# Altium project PWR_REVE.PrjPcb
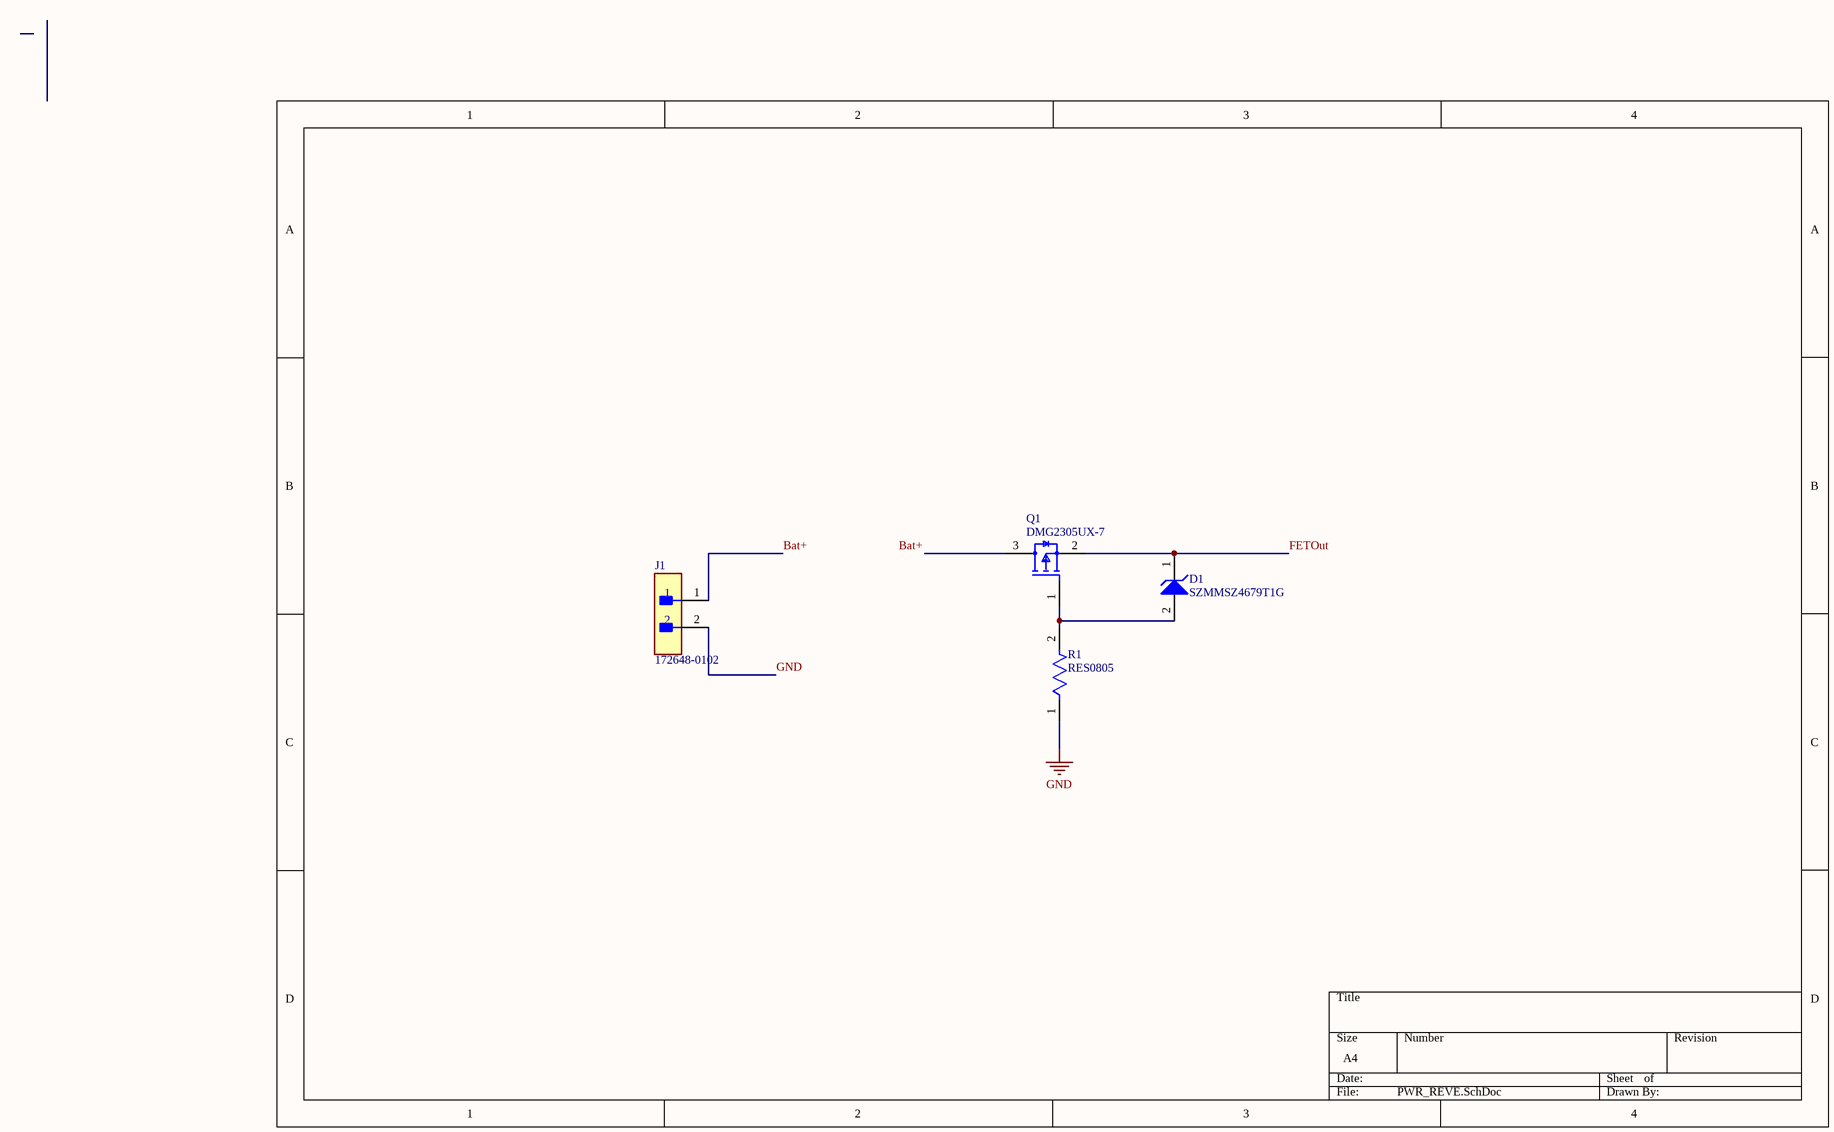
[diagram p0: PWR_REVE.SchDoc]
2 sheets, 16 parts. Net scope: global (net labels, ports and power ports of the same name join across sheets).
Board file: PWR_REVE.PcbDoc
Sheets:
  PWR_REVE.SchDoc
  PWR_REVE_2.SchDoc

## Sheet PWR_REVE.SchDoc
size A4; SheetNumber: 1; SheetTotal: 2

### Parts
D1  SZMMSZ4679T1G  [ONSC-SOD-123-2-425-04_V]
J1  172648-0102  [FP-172648-0102-MFG]
Q1  DMG2305UX-7  [FP-SOT23-IPC_B]
R1  RES0805  [FP-RMCF0805-IPC_C]

### Nets
GND: J1.2 R1.1
Bat+: J1.1 Q1.3(DRAIN)
FETOut: D1.1(K) Q1.2(SOURCE)
NetD1_2: D1.2(A) Q1.1(GATE) R1.2

### Library data of the parts
D1 = CMP-1060-00472-1: Zener Voltage Regulator, 500 mW, 2-Pin SOD-123, Pb-Free, Tape and Reel; Manufacturer: On Semiconductor; P Max (W): 0.5; VZ Typ (V): 2; ComponentLink3Description: Package Specification; Mounting Technology: Surface Mount; ComponentLink1URL: http://www.onsemi.com/; PackageVersion: Rev. G, 10/2009; ComponentLink3URL: http://www.onsemi.com/pub_link/Collateral/425-04.PDF; ComponentLink1Description: Manufacturer URL; ComponentLink2Description: Datasheet; PackageReference: SOD-123-2-425-04; PackageDescription: 2-Pin SOD, Body 1.6 x 2.69 mm; DatasheetVersion: Rev. 9; PartNumber: SZMMSZ4679T1G; ComponentLink2URL: http://www.onsemi.com/pub_link/Collateral/MMSZ4678T1-D.PDF; Packing: Tape and Reel; RoHS: Pb-Free
J1 = CMP-04776-000216-1: CONN HEADER R/A 2POS 4.2MM
Q1 = CMP-1693-00002-4: MOSFET P-CH 20V 4.2A SOT23; Turn-On Delay Time: 10.8ns; Turn-Off Delay Time: 79.3ns; Threshold Voltage: -900mV; Rise Time: 13.7ns; Gate to Source Voltage (Vgs): 8V; Rds On Max: 52mR; Element Configuration: Single; Fall Time: 34.7ns; Max Power Dissipation: 1.4W; Drain to Source Resistance: 200mR; Number of Channels: 1; Input Capacitance: 808pF; Lead Free: Lead Free; Number of Pins: 3; Length: 3mm; Continuous Drain Current (ID): 4.2A; Contact Plating: Tin; Mount: Surface Mount; Weight: 0.000282oz; Min Operating Temperature: -55°C; Package Quantity: 3000; Drain to Source Voltage (Vdss): 20V; On-State Resistance: 52MR; Max Operating Temperature: 150°C; Height: 1.1mm; REACH SVHC: No SVHC; Packaging: Tape and Reel; Radiation Hardening: No; Case/Package: SOT-23; Width: 1.4mm
R1 = CMP-26527-000066-1: 10kΩ; Temperature Coefficient: 200ppm/°C; Max Power Dissipation: 125mW; Tolerance: 5%; Resistance: 1MR; Construction: Rectangular; Case Code (Metric): 2012; Radiation Hardening: No; Contact Plating: Tin; Military Standard: Not; Features: Automotive AEC-Q200; Resistor Type: Thick Film; Series: RMCF; Length: 2mm; Min Operating Temperature: -55°C; Case Code (Imperial): 0805; Height: 0.026inch; Mount: Surface Mount; Max Operating Temperature: 155°C; Depth: 1.25mm; Width: 0.049inch; Packaging: Tape and Reel; Number of Terminations: 2; Case/Package: 0805; Lead Free: Lead Free; RoHS Compliant: Yes

## Sheet PWR_REVE_2.SchDoc
size A4; SheetNumber: 2; SheetTotal: 2
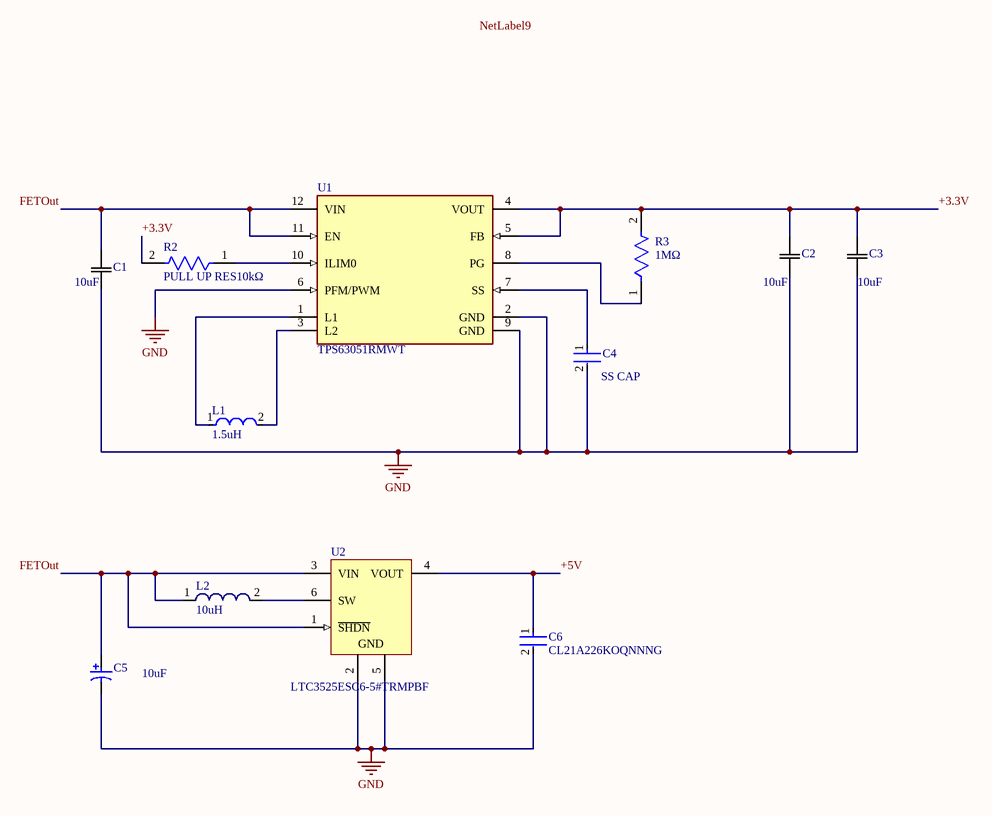
[diagram p1: PWR_REVE_2.SchDoc]

### Parts
C1  10uF  [G-188_MUR]
C2  10uF  [G-188_MUR]
C3  10uF  [G-188_MUR]
C4  SS CAP  [FP-CBR08C-MFG]
C5  10uF  [VISH-293D-A_L]
C6  CL21A226KOQNNNG  [FP-CL21-IPC_A]
L1  1.5uH  [FP-DFE252010C-IPC_C]
L2  10uH  [WE-PD2SR 7850]
R2  PULL UP RES10kΩ  [FP-RMCF0805-IPC_C]
R3  1MΩ  [FP-RMCF0805-IPC_C]
U1  TPS63051RMWT  [FP-RMW0012A-IPC_A]
U2  LTC3525ESC6-5#TRMPBF  [LT-SC6-6-SC70_N]

### Nets
GND: C1.1 C2.1 C3.1 C4.2 C5.2 C6.2 U1.2(GND) U1.6(PFM/PWM) U1.9(GND) U2.2(GND) U2.5(GND)
+3.3V: C2.2 C3.2 R2.2 R3.2 U1.4(VOUT) U1.5(FB)
+5V: C6.1 U2.4(VOUT)
FETOut: C1.2 C5.1 L2.1 U1.11(EN) U1.12(VIN) U2.1(~{SHDN}) U2.3(VIN)
NetC4_1: C4.1 U1.7(SS)
NetL1_1: L1.1 U1.1(L1)
NetL1_2: L1.2 U1.3(L2)
NetL2_2: L2.2 U2.6(SW)
NetR2_1: R2.1 U1.10(ILIM0)
NetR3_1: R3.1 U1.8(PG)

### Notes on the sheet
- Labels drawn without touching a wire or pin: NetLabel9

### Library data of the parts
C1-C3 = GRM188R60J106ME84D: No Description Available; Mfr_Name: Murata; Type: DEV; Copyright: Copyright (C) 2022 Ultra Librarian. All rights reserved.; Manufacturer_Part_Number: GRM188R60J106ME84D; Digi-Key_Part_Number_1: 490-7316-1-ND; Digi-Key_Part_Number_2: 490-7316-2-ND; Digi-Key_Part_Number_3: 490-7316-6-ND; RefDes: RefDes
C4 = CMP-03020-025427-1: CAP0805; Manufacturer: KEMET; Manufacturer Part Number: CBR08C470FAGAC; Temperature Coefficient: 30ppm/°C; Material: Ceramic; Value: 47 pF; Tolerance: 0.01; Temperature Characteristic: C0G; Voltage Rating: 250 V; Temperature Range High: +125°C; ComponentLink2Description: Datasheet; Octopart: https://octopart.com/cbr08c470fagac-kemet-23843310; Lead Free: Yes; Device Class L3: Ceramic Capacitors; Temperature Range Low: -55°C; Height: 0.95mm; RoHS: TRUE; Capacitance: 47 pF; ComponentLink2URL: https://content.kemet.com/datasheets/KEM_C1030_CBR_SMD.pdf; Device Class L2: Capacitors; Package: CBR08C; Temperature: -55°C to +125°C; Device Class L1: Passive Components; Category: Cap; Automotive: No; Digikey Description: CAP CER 47PF 250V C0G/NP0 0805; Ipc Land Pattern Name: CAPC200125X85
C5 = CMP-2000-05555-1: Tantalum Capacitor, 10 uF, +/- 10%, 10 V, -55 to 125 degC, 1206 (3216 Metric), RoHS, Tape and Reel; Manufacturer: Vishay; DCL: 1uA; DELETED: Compliant; Seal: NotRequired; Product Depth (mm): 1.6mm; Product Diameter (mm): NotRequiredmm; Product Length (mm): 3.2mm; Polarity: Polar; Capacitance: 10000000pF; Case Style: Molded; ESR: 3.4ohm; DF: 6%; Voltage: 10VDC; Rad Hardened: No; Mounting Style: SurfaceMount; Failure Rate: NotRequired; Length W/Weld: NotRequiredmm; Package Description: 2-Pin Surface Mount Device, Body 3.2 x 1.6 mm; Insulation: NotRequired; Case Code: A; Packaging: TapeandReel; Wire Form: NotRequired; Seated Plane Height: NotRequiredmm; Construction: SMTChip; Package Reference: 293D-A; Manufacturer URL: http://www.vishay.com/; Package / Case: 3216-18; Lead Spacing (nom): NotRequiredmm; Datasheet Version: 08/2016; Product Height (mm): 1.6mm; Tolerance (+ or -): 10%; Length W/Weld (max): NotRequiredmm; Operating Temp Range: -55Cto125C; Mounting Technology: SurfaceMount; Datasheet URL: http://www.vishay.com/docs/40002/293d.pdf
C6 = CMP-13271-000211-1: CL21 Series 0805 22uF 16V ±10% Tolerance X5R Multilayer Ceramic Chip Capacitor; Max Operating Temperature: 85°C; Width: 0.049inch; Tolerance: 10%; Thickness: 0.055inch; Mount: Surface Mount; Case/Package: 0805; Lead Free: Lead Free; Packaging: Tape and Reel; Voltage Rating: 16V; Package Quantity: 3000; Min Operating Temperature: -55°C; Capacitance: 22uF; Length: 0.079inch
L1 = CMP-06042-002962-1: Shielded Wirewound Inductor 1.5uH  1900mA 0.108Ω 1008 (2520); Core Material: Ferrite; DC Resistance (DCR): 108mR; Max DC Current: 2.3A; Test Frequency: 1MHz; Tolerance: 20%; Current Rating: 2.1A; Case Code (Imperial): 1008; Depth: 2mm; Height - Seated (Max): 0.039inch; Case/Package: 1008; Width: 0.079inch; Case Code (Metric): 2520; Max Operating Temperature: 85°C; Inductance: 1.5uH; Resistor Type: Wirewound; Packaging: Tape and Reel; Mount: Surface Mount; Shielding: Shielded; Length: 0.098inch; Min Operating Temperature: -40°C
L2 = CMP-1397-00015-1: Shielded Power Inductor WE-PD2SR, L=10.0 µH; Manufacturer: Wuerth Elektronik; PartNumber: 744787100; Inductance: 10.0 ÂµH; PackageReference: WE-PD2SR 7850; ComponentLink2URL: http://www.we-online.de/katalog/media/pdf/744787100.pdf; ComponentLink1URL: http://www.we-online.com; ComponentLink2Description: Datasheet; ComponentLink1Description: Manufacturer URL
R2 = CMP-26527-000066-1: 10kΩ 0805; Temperature Coefficient: 200ppm/°C; Max Power Dissipation: 125mW; Tolerance: 5%; Resistance: 1MR; Construction: Rectangular; Case Code (Metric): 2012; Radiation Hardening: No; Contact Plating: Tin; Military Standard: Not; Features: Automotive AEC-Q200; Resistor Type: Thick Film; Series: RMCF; Length: 2mm; Min Operating Temperature: -55°C; Case Code (Imperial): 0805; Height: 0.026inch; Mount: Surface Mount; Max Operating Temperature: 155°C; Depth: 1.25mm; Width: 0.049inch; Packaging: Tape and Reel; Number of Terminations: 2; Case/Package: 0805; Lead Free: Lead Free; RoHS Compliant: Yes
R3 = CMP-26527-000066-1: 1MΩ ±5% 0.125W 0805 Thick Film Chip Resistor AEC-Q200 compliant; Temperature Coefficient: 200ppm/°C; Max Power Dissipation: 125mW; Resistance: 1MR; Construction: Rectangular; Case Code (Metric): 2012; Radiation Hardening: No; Contact Plating: Tin; Military Standard: Not; Features: Automotive AEC-Q200; Resistor Type: Thick Film; Series: RMCF; Length: 2mm; Min Operating Temperature: -55°C; Case Code (Imperial): 0805; Height: 0.026inch; Mount: Surface Mount; Max Operating Temperature: 155°C; Depth: 1.25mm; Width: 0.049inch; Packaging: Tape and Reel; Number of Terminations: 2; Case/Package: 0805; Tolerance: 5%; Lead Free: Lead Free; RoHS Compliant: Yes
U1 = CMP-04918-000317-1: IC REG BCK BST 3.3V 500MA 12VQFN; Number of Outputs: 1; Output Configuration: Positive; Quiescent Current: 45uA; Efficiency: 95%; Max Input Voltage: 5.5V; Output Type: Fixed; Topology: Buck-Boost; Synchronous Rectifier: Yes; Switching Frequency: 2.5MHz; Min Input Voltage: 2.5V; Lead Free: Lead Free; Min Output Voltage: 3.3V; Packaging: Tape and Reel; Max Operating Temperature: 85°C; Output Current: 500mA; Mount: Surface Mount; Min Operating Temperature: -40°C; RoHS Compliant: Yes; Nominal Output Voltage: 3.3V; Case/Package: VQFN; Output Voltage: 5.5V; REACH SVHC: No SVHC; Number of Pins: 12; Max Output Current: 500mA
U2 = CMP-0492-02056-1: 400 mA Micropower Synchronous Step-Up DC/DC Converter with Output Disconnect, 6-pin SOT23 (SC6-6), -40 to 85 degC, Pb-Free, Mini Tape and Reel; Manufacturer: Linear Technology; Number of Outputs: 1; ComponentLink2URL: http://cds.linear.com/docs/en/datasheet/3525fb.pdf; PackageVersion: Rev. B, 06/2010; ComponentLink1Description: Manufacturer URL; ComponentLink3URL: http://cds.linear.com/docs/en/packaging/SOT_6_05-08-1638.pdf; ComponentLink1URL: http://www.linear.com/; RoHS: TRUE; PartNumber: LTC3525ESC6-5#TRMPBF; ComponentLink2Description: Datasheet; ComponentLink3Description: Package Specification; Packing: Mini Tape and Reel; DatasheetVersion: Rev. B; PackageReference: SC6-6; PackageDescription: 6-Pin Plastic SC70, Body 2 x 1.25 mm, Pitch 0.65 mm; Mounting Technology: Surface Mount; Code_JEDEC: MO-203

## Nets that join several sheets
GND: PWR_REVE (J1.2 R1.1), PWR_REVE_2 (11 pins)
FETOut: PWR_REVE (D1.1 Q1.2), PWR_REVE_2 (7 pins)